# EAGLE design gems-NHD (EAGLE 9.1.3)
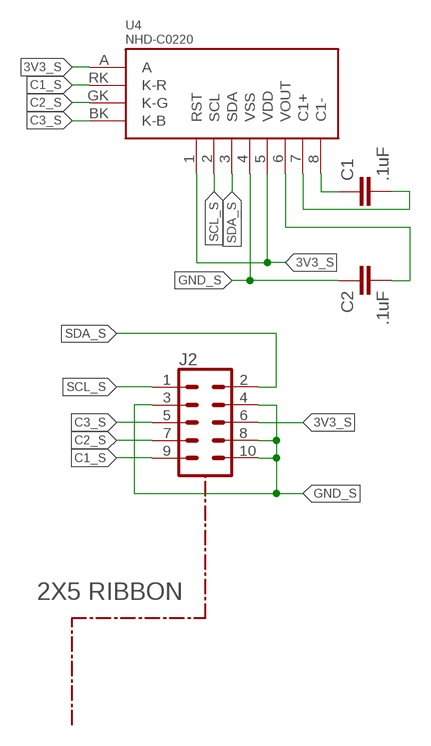
[diagram p0: schematic, sheet 1]

## Parts
C1  .1uF  C-EU025-025X050  [C025-025X050]
C2  .1uF  C-EU025-025X050  [C025-025X050]
J2  CONN_05X2SHD-NS  [2X5-SHROUDED-NS]
U4  NHD‐C0220  [NHD-C0220]

## Nets
3V3_S: J2.6 U4.1(RST) U4.5(VDD) U4.A
C1_S: J2.9 U4.RK(K-R)
C2_S: J2.7 U4.GK(K-G)
C3_S: J2.5 U4.BK(K-B)
GND_S: C2.1 J2.3 J2.4 J2.8 J2.10 U4.4(VSS)
N$15: C1.1 U4.8(C1-)
N$16: C1.2 U4.7(C1+)
N$17: C2.2 U4.6(VOUT)
SCL_S: J2.1 U4.2(SCL)
SDA_S: J2.2 U4.3(SDA)

## Notes on the sheet
- 2X5 RIBBON

## Library data of the parts
C1 C2 = gems:C-EU: CAPACITOR, European symbol; SPICEPREFIX: C
J2 = gems:CONN_05X2: Multi connection point. Often used as Generic Header-pin footprint for 0.1 inch spaced/style header connections For AVR SPI programming port, see special device with nice symbol: "AVR_SPI_PROG_5x2.dev" You can populate with any combo of single row headers, but if you'd like an exact match, check these: 2x5 AVR ICSP Male Header <https://www.sparkfun.com/products/778> (PRT-00778) 2x5 Pin Shrouded Header <https://www.sparkfun.com/products/8506> (PRT-08506) On any of the 0.1 inch spaced packages, you can populate with these: Break Away Headers - Straight <https://www.sparkfun.com/products/116> (PRT-00116) Break Away Male Headers - Right Angle <https://www.sparkfun.com/products/553> (PRT-00553) Female Headers <https://www.sparkfun.com/products/115> (PRT-00115) Break Away Headers - Machine Pin <https://www.sparkfun.com/products/117> (PRT-00117) Break Away Female Headers - Swiss Machine Pin <https://www.sparkfun.com/products/743> (PRT-00743) Special note: the shrouded connector mates well with our 5x2 ribbon cables: 2x5 Pin IDC Ribbon Cable <https://www.sparkfun.com/products/8535> (PRT-08535); PROD_ID: CONN-08671; SF_ID: PRT-08506
U4 = gems:NHD‐C0220

## Board
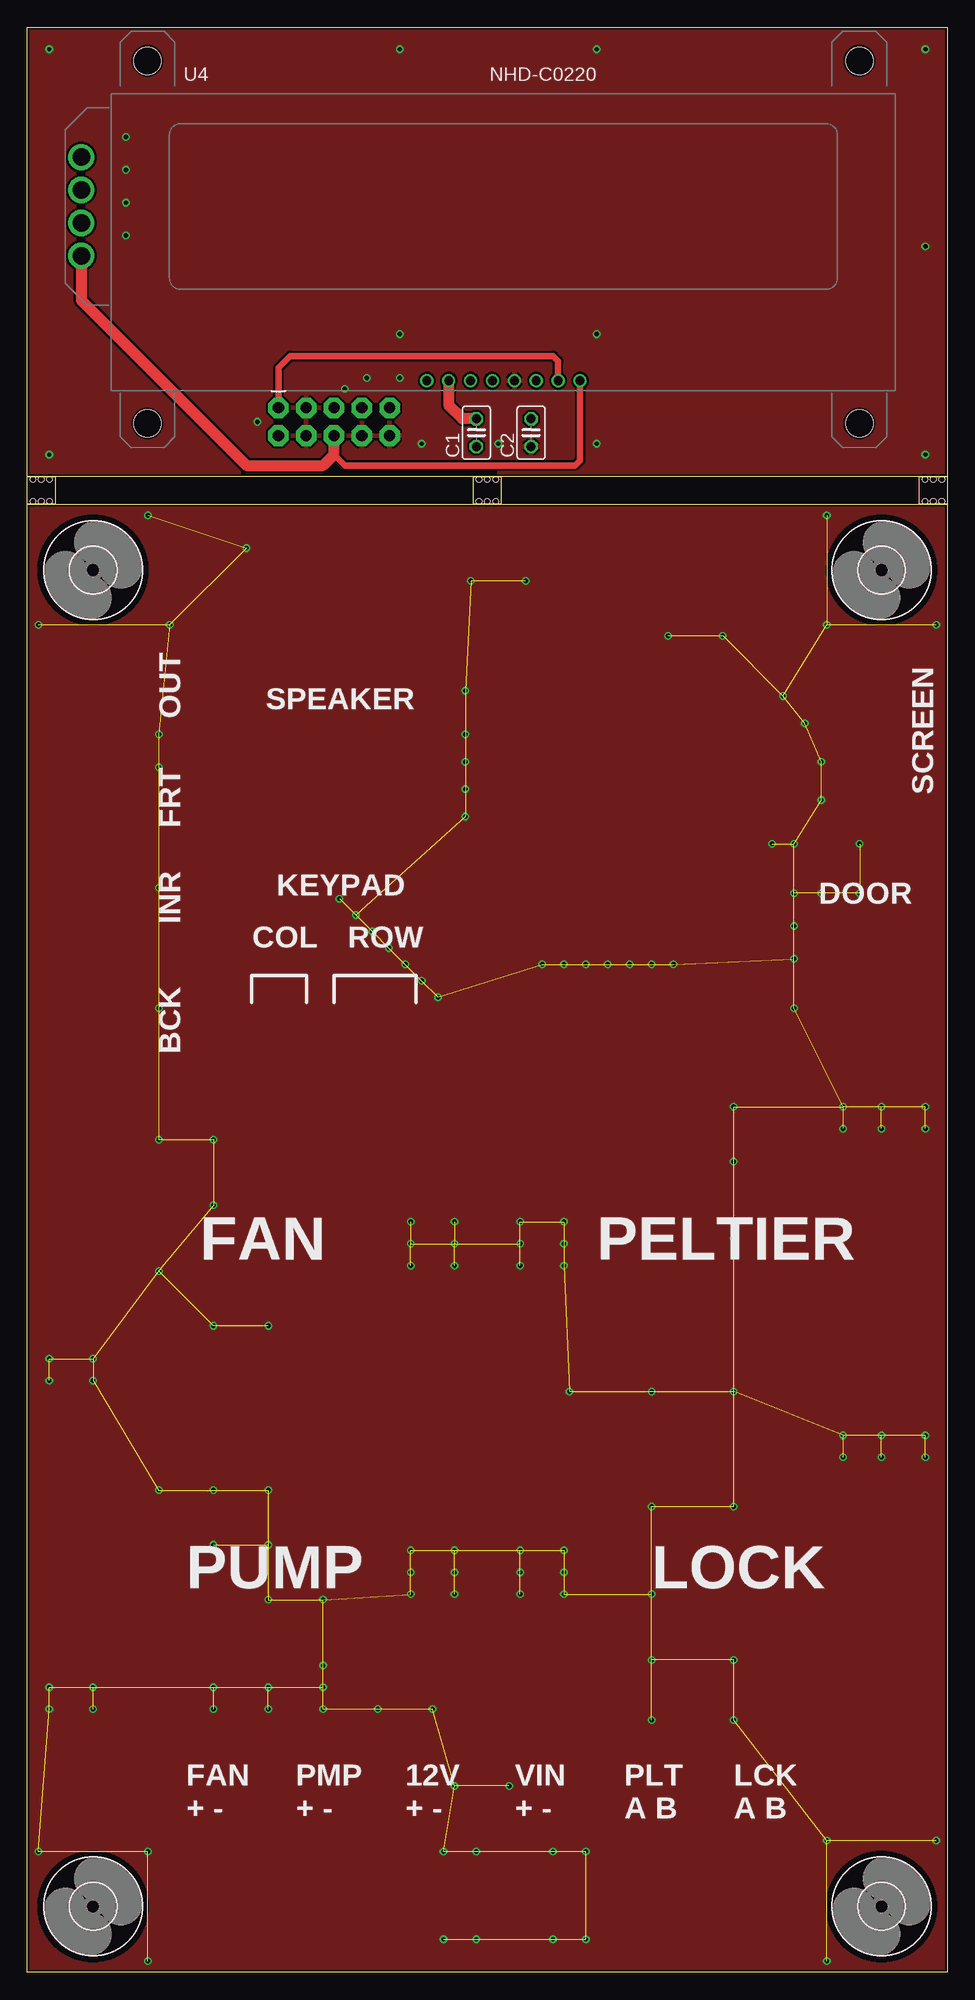
[diagram p1: board, top side]
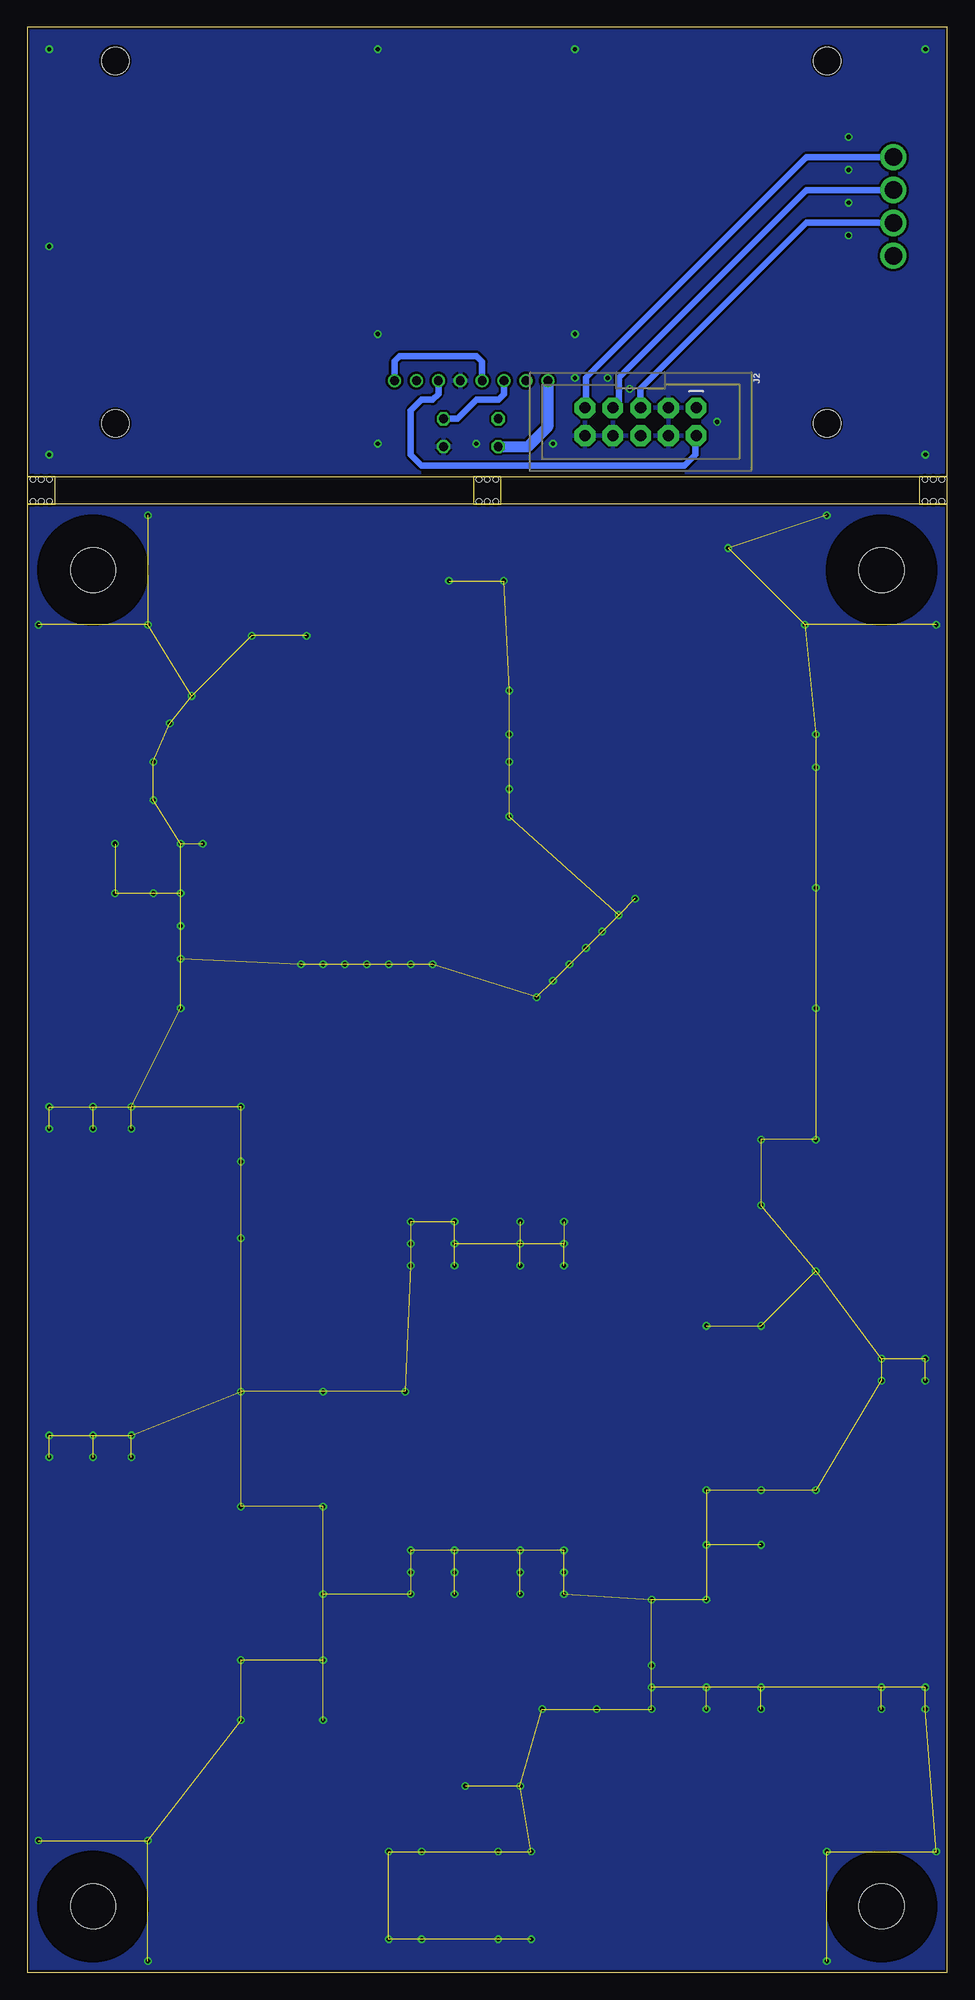
[diagram p2: board, bottom side, seen from below]

Size 84 x 177.54 mm. Coordinates in mm from the lower left corner, seen from the top.
Outline: 0,177.54 84,177.54 84,136.54 0,136.54 0,177.54
Outline: 0,134 84,134 84,0 0,0 0,134
Copper layers (1*16): Top 0.035mm / dielectric 1.5mm / Bottom 0.035mm
Design rules "littleBitsDRC": minimum track width 0.2mm, minimum drill 0.2mm, track to track 0.2mm, track to pad 0.2mm, pad to pad 0.2mm, via to via 0.2mm, smd to smd 0mil, copper to edge 0.2mm, drill to drill 0.2mm, minimum pad ring 0.1mm, minimum via ring 0.15mm, stop-mask expansion 0.1mm, vias tented up to drill 0.5mm, thermal gap 0.2mm

### Footprints (pad centres in the part's own frame; a part is rotated, then mirrored left to right if it is on the bottom)
C025-025X050 = drill 0.813 octagon: 1 -1.27,0; 2 1.27,0
2X5-SHROUDED-NS = drill 1.016 pad 1.88 octagon: 1 -1.27,5.08; 2 1.27,5.08; 3 -1.27,2.54; 4 1.27,2.54; 5 -1.27,0; 6 1.27,0; 7 -1.27,-2.54; 8 1.27,-2.54; 9 -1.27,-5.08; 10 1.27,-5.08
NHD-C0220 = drill 0.8: 1 7,-15.9; 2 5,-15.9; 3 3,-15.9; 4 1,-15.9; 5 -1,-15.9; 6 -3,-15.9; 7 -5,-15.9; 8 -7,-15.9 | drill 1.6: A -38.55,-4.5; BK -38.55,-1.5; GK -38.55,1.5; RK -38.55,4.5 | hole 2.5: -32.5,-19.8; 32.5,-19.8; -32.5,13.3; 32.5,13.3
4,1 = hole 4.1: 0,0
SUPPORT_TAB_100MIL = hole 0.508: 0,1.016; -0.762,1.016; 0.762,1.016; 0,-1.016; -0.762,-1.016; 0.762,-1.016

### Placement (x,y rotation side)
C1  41,140.54 90 top
C2  46,140.54 90 top
J2  28,141.54 270 bottom
U4  43.47,161.19 0 top
U$1  [4,1]  6,128 0 top
U$2  [4,1]  78,128 0 top
U$3  [SUPPORT_TAB_100MIL]  1.27,135.27 0 top
U$4  [SUPPORT_TAB_100MIL]  42,135.27 0 top
U$5  [SUPPORT_TAB_100MIL]  82.73,135.27 0 top
U$6  [4,1]  6,6 0 top
U$7  [4,1]  78,6 0 top

### Tracks (layer width: path | path; a pad name or v marks a point on that pad's centre or on a via)
3V3_S
  Top 0.6: U4.1 50.47,138.01 50,137.54 29,137.54 28,138.54
  Top 1: J2.6 28,138.54 27,137.54 20,137.54 4.92,152.62 U4.A
  Bottom 0.6: U4.5 42.47,147.01 43,147.54 50,147.54 50.47,147.07 U4.1
C1_S
  Bottom 0.6: U4.RK 12.85,165.69 33,145.54 33,142.89 J2.9
C2_S
  Bottom 0.6: U4.GK 12.85,162.69 30,145.54 30,143.35 J2.7
C3_S
  Bottom 0.6: U4.BK 12.85,159.69 28,144.54 J2.5
GND  (via drill 0.4)  (141 unrouted)
  other vias: 38,3 41,3 38,11 41,11 48,11 51,11 48,3 51,3 11,1 1,11 11,11 73,1 73,12 83,12 83,123 73,123 73,133 11,133 1,123 13,123 20,130 12,113 12,110 12,99 12,88 12,76 12,64 12,44 40,117 40,113 40,108 40,110.5 40,105.5 28.5,98 30,96.5 31.5,95 33,93.5 34.5,92 36,90.5 37.5,89 47,92 49,92 51,92 53,92 55,92 57,92 59,92 40.5,127 45.5,127 58.5,122 63.5,122 69,116.5 71,114 72.5,110.5 72.5,107 70,103 68,103 70,95.5 70,98.5 70,92.5 70,88 72.5,98.5 76,98.5 76,103 78,79 78,77 82,79 82,77 74.5,77 74.5,79 82,47 82,49 78,49 78,47 74.5,47 74.5,49 45,38.5 49,38.5 49,34.5 45,34.5 49,36.5 45,36.5 45,64.5 49,64.5 49,66.5 49,68.5 45,68.5 45,66.5 39,34.5 35,34.5 35,36.5 35,38.5 39,38.5 39,36.5 39,64.5 35,64.5 39,66.5 35,66.5 35,68.5 39,68.5 2,54 2,56 6,56 6,54 2,24 2,26 6,26 6,24 17,24 17,26 22,26 22,24 27,24 27,26 32,24 37,24 22,34 22,39 17,39 17,44 27,34 27,28 39,17 44,17 17,59 22,59 22,44 17,70 17,76 57,23 57,28.5 64.5,28.5 64.5,23 57,34.5 57,42.5 64.5,42.5 57,53 64.5,53 49.5,53 64.5,67 64.5,74 64.5,79
  pour Bottom: -1,135 85,135 85,-1 -1,-1
  pour Top: -2,135 86,135 86,-2 -2,-2
GND_S  (via drill 0.4)
  other vias: 9,164.54 9,161.54 29,144.54 31,145.54 9,158.54 9,167.54 2,175.54 2,138.54 21,141.54 36,139.54 34,145.54 34,149.54 43,139.54 52,139.54 52,149.54 82,138.54 82,175.54 82,157.54 34,175.54 52,175.54
  pour Bottom (rank 2): -1,178.54 85,178.54 85,135.54 -1,135.54
  pour Top (rank 2): -2,179.54 86,179.54 86,135 -2,135
N$15
  Bottom 1: C1.1 38.27,139.27 36.47,141.07 U4.8
N$16
  Top 1: C1.2 39.73,141.81 38.47,143.07 U4.7
N$17
  Bottom 0.6: U4.6 40.47,144.07 41,143.54 43,143.54 44.73,141.81 C2.2
SCL_S
  Top 0.6: J2.1 22.92,146.46 24,147.54 48,147.54 48.47,147.07 U4.2
SDA_S
  Bottom 0.6: U4.3 46.47,144.07 47,143.54 48,143.54 49,142.54 49,138.54 48,137.54 24,137.54 23,138.54 23,140.19 J2.2

### Text on the board
tPlace: OUT | SPEAKER | FRT | SCREEN | INR | KEYPAD | DOOR | COL | ROW | BCK | FAN | PELTIER | PUMP | LOCK | FAN / + - | PMP / + - | 12V / + - | VIN / + - | PLT / A B | LCK / A B